# EAGLE design Keg Cop - Daisy Chain (EAGLE 9.6.2)
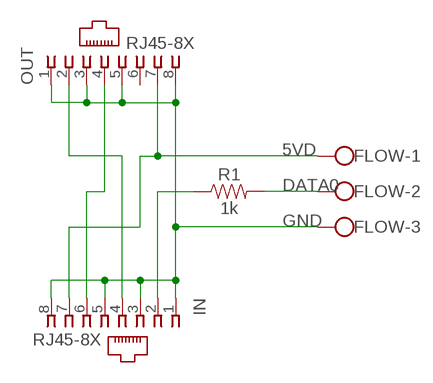
[diagram p0: schematic, sheet 1]

## Parts
FLOW  W237-103  [W237-103]
IN  RJ45-8X  [RJ45-NO-SHIELD]
OUT  RJ45-8X  [RJ45-NO-SHIELD]
R1  1k  1KOHM-HORIZ-1/4W-5%  [AXIAL-0.3]

## Nets
5VD: FLOW.1 IN.7 OUT.7
DATA0: IN.2 R1.P$1
DATA1: IN.4 OUT.2
DATA2: IN.6 OUT.4
GND: FLOW.3 IN.1 IN.3 IN.5 IN.8 OUT.1 OUT.3 OUT.5 OUT.8
N$1: FLOW.2 R1.P$2
Unconnected: OUT.6

## Library data of the parts
FLOW = con-wago-500:W237-103: WAGO SCREW CLAMP; MPN: 237-103; OC_FARNELL: unknown; OC_NEWARK: 18M7116
IN OUT = con-tycoelectronics:RJ45: CORCOM Modular RJ Jacks No Shield Source: www.tycoelectronics.com .. ENG_DS_1654001_1099_RJ_L_0507.pdf; MPN: RJ45-8X; OC_FARNELL: unknown; OC_NEWARK: 16R6101
R1 = SparkFun-Resistors:1KOHM: 1kΩ resistor A resistor is a passive two-terminal electrical component that implements electrical resistance as a circuit element. Resistors act to reduce current flow, and, at the same time, act to lower voltage levels within circuits. - Wikipedia; PROD_ID: RES-08380

## Board
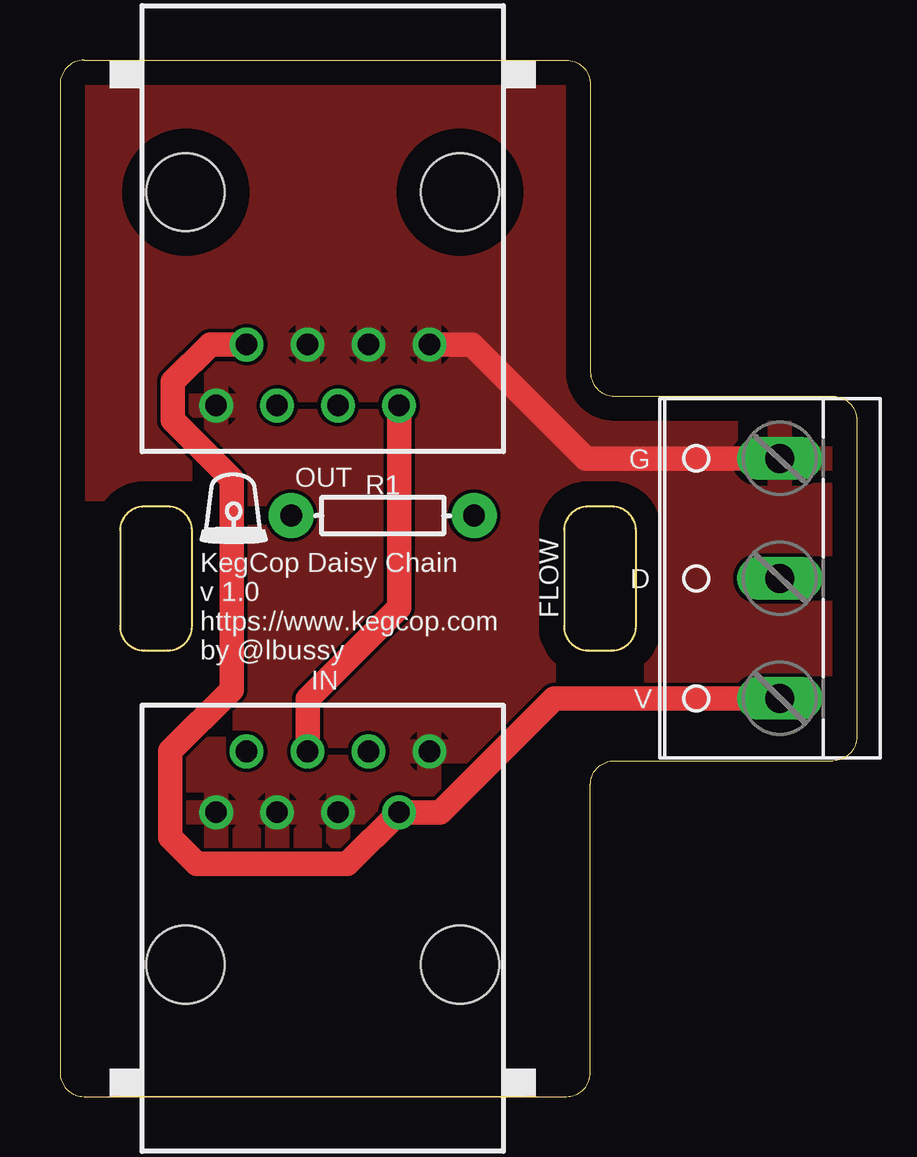
[diagram p1: board, top side]
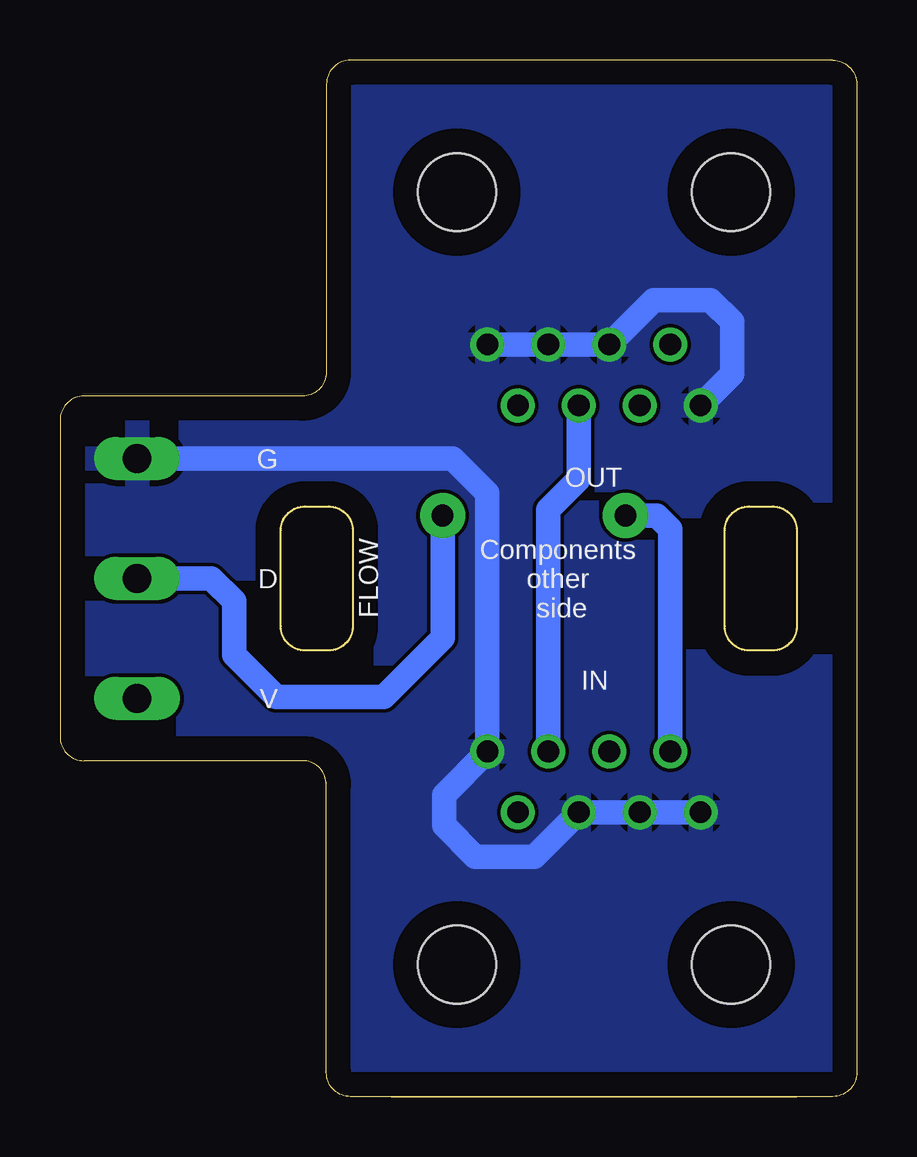
[diagram p2: board, bottom side, seen from below]

Size 33.2 x 43.22 mm. Coordinates in mm from the lower left corner, seen from the top.
Outline: 1,43.21 21.1,43.21 arc-90 22.1,42.21 22.1,30.21 arc90 23.1,29.21 32.2,29.21 arc-90 33.2,28.21 33.2,15.01 arc-90 32.2,14.01 23.1,14.01 arc90 22.1,13.01 22.1,1.01 arc-90 21.1,0.01 1,0.01 arc-90 0,1.01 0,42.21 arc-90 1,43.21
Outline: 4.5,24.61 3.5,24.61 arc90 2.5,23.61 2.5,19.61 arc90 3.5,18.61 4.5,18.61 arc90 5.5,19.61 5.5,23.61 arc90 4.5,24.61
Outline: 22,18.61 23,18.61 arc90 24,19.61 24,23.61 arc90 23,24.61 22,24.61 arc90 21,23.61 21,19.61 arc90 22,18.61
Copper layers (1*16): Top 0.035mm / dielectric 1.5mm / Bottom 0.035mm
Design rules "default": minimum track width 6mil, minimum drill 0.35mm, track to track 6mil, track to pad 6mil, pad to pad 6mil, via to via 6mil, smd to smd 6mil, copper to edge 40mil, drill to drill 6mil, minimum pad ring 10mil, minimum via ring 8mil, stop-mask expansion 4mil, vias tented up to drill 0mil, thermal gap 10mil

### Footprints (pad centres in the part's own frame; a part is rotated, then mirrored left to right if it is on the bottom)
W237-103 = drill 1.194 long: 1 -5,-1.29; 2 0,-1.29; 3 5,-1.29
RJ45-NO-SHIELD = drill 0.9 pad 1.4: 1 -4.445,6.35; 2 -3.175,8.89; 3 -1.905,6.35; 4 -0.635,8.89; 5 0.635,6.35; 6 1.905,8.89; 7 3.175,6.35; 8 4.445,8.89 | hole 3.251: -5.715,0; 5.715,0
AXIAL-0.3 = drill 0.9 pad 1.88: P$1 -3.81,0; P$2 3.81,0

### Placement (x,y rotation side)
FLOW  28.7,21.61 90 top
IN  10.95,5.51 0 top
OUT  10.95,37.71 180 top
R1  13.45,24.23 0 top

### Tracks (layer width: path | path; a pad name or v marks a point on that pad's centre or on a via)
5VD
  Top 1.016: FLOW.1 20.6,16.61 15.85,11.86 IN.7 11.97,9.71 5.7,9.71 4.6,10.81 4.6,14.41 7.15,16.96 7.15,25.76 4.7,28.21 4.7,29.81 6.25,31.36 OUT.7
DATA0
  Bottom 1.016: IN.2 7.78,23.68 8.33,24.23 R1.P$1
DATA1
  Top 1.016: IN.4 10.31,16.59 14.12,20.4 OUT.2
DATA2
  Bottom 1.016: IN.6 12.86,24.48 11.59,25.75 OUT.4
GND
  Top 1.016: OUT.1 17.15,31.36 21.9,26.61 FLOW.3
  Bottom 1.016: IN.1 IN.3 IN.5 13.44,10.01 15.9,10.01 17.2,11.31 17.2,12.6 IN.8 15.39,25.17 16.84,26.61 FLOW.3 | OUT.1 OUT.3 OUT.5 8.46,33.21 6.1,33.21 5.2,32.31 5.2,30.13 OUT.8
  pour Top: 21.1,0.01 1,0.01 arc-90 0,1.01 0,42.21 arc-90 1,43.21 21.1,43.21 arc-90 22.1,42.21 22.1,30.21 arc90 23.1,29.21 32.2,29.21 arc-90 33.2,28.21 33.2,15.01 arc-90 32.2,14.01 23.1,14.01 arc90 22.1,13.01 22.1,1.01 arc-90
  pour Bottom: 21.1,0.01 1,0.01 arc-90 0,1.01 0,42.21 arc-90 1,43.21 21.1,43.21 arc-90 22.1,42.21 22.1,30.21 arc90 23.1,29.21 32.2,29.21 arc-90 33.2,28.21 33.2,15.01 arc-90 32.2,14.01 23.1,14.01 arc90 22.1,13.01 22.1,1.01 arc-90
N$1
  Bottom 1.016: R1.P$2 17.26,19.12 19.71,16.66 24.19,16.66 25.94,18.42 25.94,20.66 26.89,21.61 FLOW.2

### Text on the board
tNames: G | D | KegCop Daisy Chain / v 1.0 / https://www.kegcop.com / by @lbussy | V
bNames: G | OUT | Components / other / side | FLOW | D | IN | V